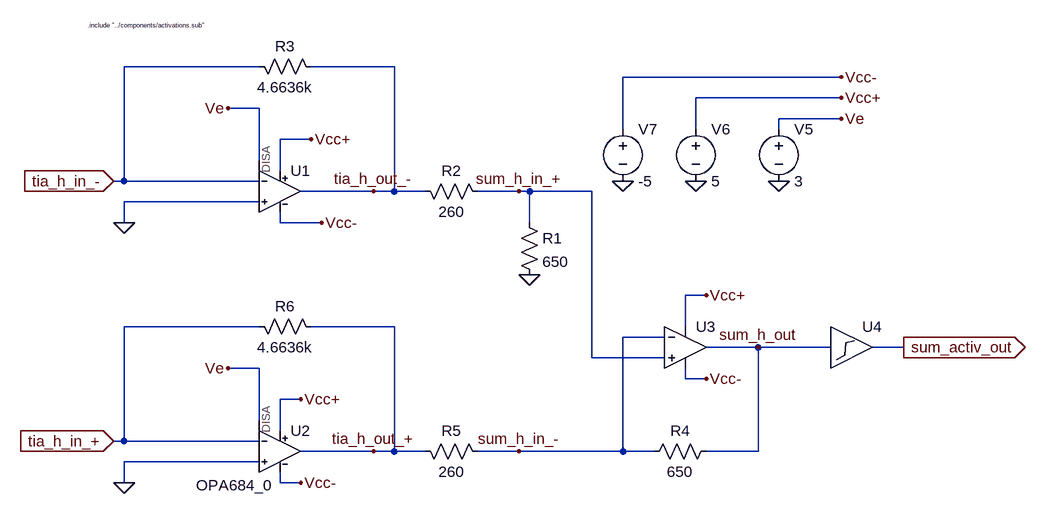
[diagram p0: schematic column_activ_relu.asc]
column_activ_relu.asc, the LTspice schematic file:
Version 4
SHEET 1 2360 680
WIRE 160 -128 -48 -128
WIRE 368 -128 240 -128
WIRE 1056 -112 720 -112
WIRE 1056 -80 832 -80
WIRE 160 -64 112 -64
WIRE 1056 -48 960 -48
WIRE 720 -32 720 -112
WIRE 832 -32 832 -80
WIRE 960 -32 960 -48
WIRE 240 -16 192 -16
WIRE 160 16 160 -64
WIRE 192 32 192 -16
WIRE -48 48 -48 -128
WIRE -48 48 -64 48
WIRE 160 48 -48 48
WIRE 336 64 224 64
WIRE 368 64 368 -128
WIRE 368 64 336 64
WIRE 416 64 368 64
WIRE 560 64 496 64
WIRE 576 64 560 64
WIRE 672 64 576 64
WIRE 160 80 -48 80
WIRE -48 112 -48 80
WIRE 192 112 192 96
WIRE 256 112 192 112
WIRE 576 112 576 64
WIRE 848 224 816 224
WIRE 160 272 -48 272
WIRE 368 272 240 272
WIRE 816 272 816 224
WIRE 784 288 720 288
WIRE 928 304 848 304
WIRE 1040 304 928 304
WIRE 1152 304 1104 304
WIRE 672 320 672 64
WIRE 784 320 672 320
WIRE 160 336 112 336
WIRE 816 352 816 336
WIRE 848 352 816 352
WIRE 224 384 192 384
WIRE 160 416 160 336
WIRE 192 432 192 384
WIRE -48 448 -48 272
WIRE -48 448 -64 448
WIRE 160 448 -48 448
WIRE 336 464 224 464
WIRE 368 464 368 272
WIRE 368 464 336 464
WIRE 416 464 368 464
WIRE 560 464 496 464
WIRE 720 464 720 288
WIRE 720 464 560 464
WIRE 768 464 720 464
WIRE 928 464 928 304
WIRE 928 464 848 464
WIRE 160 480 -48 480
WIRE -48 512 -48 480
WIRE 192 512 192 496
WIRE 224 512 192 512
FLAG -48 112 0
FLAG 576 192 0
FLAG 560 64 sum_h_in_+
FLAG 336 64 tia_h_out_-
FLAG 960 48 0
FLAG 832 48 0
FLAG 720 48 0
FLAG 1056 -112 Vcc-
FLAG 1056 -80 Vcc+
FLAG 1056 -48 Ve
FLAG 240 -16 Vcc+
FLAG 256 112 Vcc-
FLAG 112 -64 Ve
FLAG -48 512 0
FLAG 560 464 sum_h_in_-
FLAG 336 464 tia_h_out_+
FLAG 224 384 Vcc+
FLAG 224 512 Vcc-
FLAG 112 336 Ve
FLAG 848 352 Vcc-
FLAG 848 224 Vcc+
FLAG 928 304 sum_h_out
FLAG -64 448 tia_h_in_+
IOPIN -64 448 In
FLAG -64 48 tia_h_in_-
IOPIN -64 48 In
FLAG 1152 304 sum_activ_out
IOPIN 1152 304 Out
SYMBOL res 560 96 R0
SYMATTR InstName R1
SYMATTR Value 650
SYMBOL res 512 80 M270
WINDOW 0 32 56 VTop 2
WINDOW 3 0 56 VBottom 2
SYMATTR InstName R2
SYMATTR Value 260
SYMBOL res 256 -112 M270
WINDOW 0 32 56 VTop 2
WINDOW 3 0 56 VBottom 2
SYMATTR InstName R3
SYMATTR Value 4.6636k
SYMBOL MySym\\opamp2_custom 192 0 R0
WINDOW 3 16 96 Invisible 2
SYMATTR Value ""
SYMATTR InstName U1
SYMATTR SpiceModel OPA684_0
SYMBOL voltage 960 -48 R0
WINDOW 123 0 0 Left 0
WINDOW 39 0 0 Left 0
SYMATTR InstName V5
SYMATTR Value 3
SYMBOL voltage 832 -48 R0
WINDOW 123 0 0 Left 0
WINDOW 39 0 0 Left 0
SYMATTR InstName V6
SYMATTR Value 5
SYMBOL voltage 720 -48 R0
WINDOW 123 0 0 Left 0
WINDOW 39 0 0 Left 0
SYMATTR InstName V7
SYMATTR Value -5
SYMBOL res 864 448 R90
WINDOW 0 0 56 VBottom 2
WINDOW 3 32 56 VTop 2
SYMATTR InstName R4
SYMATTR Value 650
SYMBOL res 512 480 M270
WINDOW 0 32 56 VTop 2
WINDOW 3 0 56 VBottom 2
SYMATTR InstName R5
SYMATTR Value 260
SYMBOL res 256 288 M270
WINDOW 0 32 56 VTop 2
WINDOW 3 0 56 VBottom 2
SYMATTR InstName R6
SYMATTR Value 4.6636k
SYMBOL MySym\\opamp2_custom 192 400 R0
WINDOW 3 16 96 Invisible 2
WINDOW 38 -129 116 Left 2
SYMATTR Value ""
SYMATTR SpiceModel OPA684_0
SYMATTR InstName U2
SYMBOL OpAmps\\opamp2 816 240 R0
WINDOW 3 16 96 Invisible 2
SYMATTR Value ""
SYMATTR InstName U3
SYMATTR SpiceModel MAX4223
SYMBOL MySym\\activ 1072 240 R0
WINDOW 3 10 86 Invisible 2
SYMATTR Value ""
SYMATTR InstName U4
SYMATTR SpiceModel ReLU
TEXT -104 -192 Left 0 !.include "../components/activations.sub"

The netlist it stands for:
* column_activ_relu.asc
R1 sum_h_in_+ 0 650
R2 sum_h_in_+ tia_h_out_- 260
R3 tia_h_out_- tia_h_in_- 4.6636k
XU1 0 tia_h_in_- Vcc+ Vcc- tia_h_out_- Ve OPA684_0  ; pins In+ In- V+ V- OUT DISA
V5 Ve 0 3
V6 Vcc+ 0 5
V7 Vcc- 0 -5
R4 sum_h_out sum_h_in_- 650
R5 sum_h_in_- tia_h_out_+ 260
R6 tia_h_out_+ tia_h_in_+ 4.6636k
XU2 0 tia_h_in_+ Vcc+ Vcc- tia_h_out_+ Ve OPA684_0  ; pins In+ In- V+ V- OUT DISA
XU3 sum_h_in_+ sum_h_in_- Vcc+ Vcc- sum_h_out MAX4223  ; pins In+ In- V+ V- OUT
XU4 sum_h_out sum_activ_out ReLU  ; pins In OUT
.include "../components/activations.sub"
.backanno
.end